# EAGLE design Keyboard (EAGLE 9.6.2)
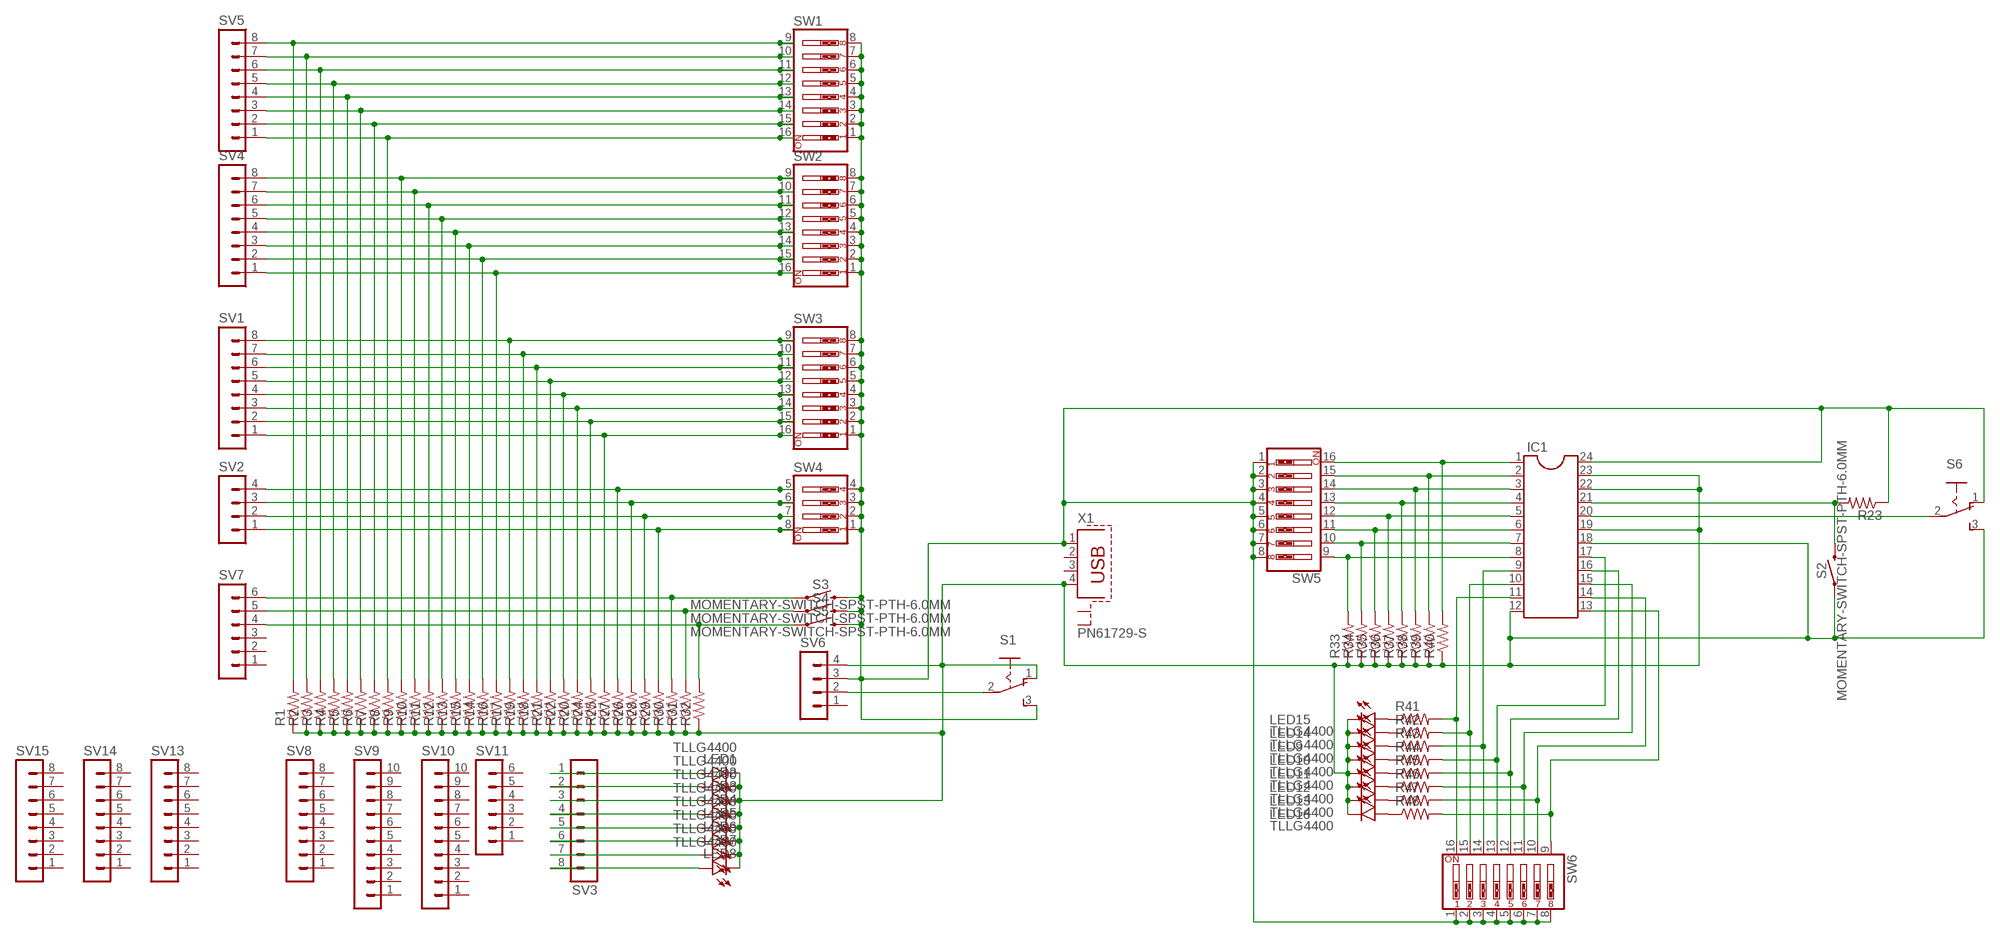
[diagram p0: schematic, sheet 1]

## Parts
IC1  DIL24-6  [DIL24-6]
LED1  TLLG4400  [LED3MM]
LED2  TLLG4400  [LED3MM]
LED3  TLLG4400  [LED3MM]
LED4  TLLG4400  [LED3MM]
LED5  TLLG4400  [LED3MM]
LED6  TLLG4400  [LED3MM]
LED7  TLLG4400  [LED3MM]
LED8  TLLG4400  [LED3MM]
LED9  TLLG4400  [LED3MM]
LED10  TLLG4400  [LED3MM]
LED11  TLLG4400  [LED3MM]
LED12  TLLG4400  [LED3MM]
LED13  TLLG4400  [LED3MM]
LED14  TLLG4400  [LED3MM]
LED15  TLLG4400  [LED3MM]
LED16  TLLG4400  [LED3MM]
R1  R-US_0207/2V  [0207/2V]
R2  R-US_0207/2V  [0207/2V]
R3  R-US_0207/2V  [0207/2V]
R4  R-US_0207/2V  [0207/2V]
R5  R-US_0207/2V  [0207/2V]
R6  R-US_0207/2V  [0207/2V]
R7  R-US_0207/2V  [0207/2V]
R8  R-US_0207/2V  [0207/2V]
R9  R-US_0207/2V  [0207/2V]
R10  R-US_0207/2V  [0207/2V]
R11  R-US_0207/2V  [0207/2V]
R12  R-US_0207/2V  [0207/2V]
R13  R-US_0207/2V  [0207/2V]
R14  R-US_0207/2V  [0207/2V]
R15  R-US_0207/2V  [0207/2V]
R16  R-US_0207/2V  [0207/2V]
R17  R-US_0207/2V  [0207/2V]
R18  R-US_0207/2V  [0207/2V]
R19  R-US_0207/2V  [0207/2V]
R20  R-US_0207/2V  [0207/2V]
R21  R-US_0207/2V  [0207/2V]
R22  R-US_0207/2V  [0207/2V]
R23  R-US_0207/2V  [0207/2V]
R24  R-US_0207/2V  [0207/2V]
R25  R-US_0207/2V  [0207/2V]
R26  R-US_0207/2V  [0207/2V]
R27  R-US_0207/2V  [0207/2V]
R28  R-US_0207/2V  [0207/2V]
R29  R-US_0207/2V  [0207/2V]
R30  R-US_0207/2V  [0207/2V]
R31  R-US_0207/2V  [0207/2V]
R32  R-US_0207/2V  [0207/2V]
R33  R-US_0207/2V  [0207/2V]
R34  R-US_0207/2V  [0207/2V]
R35  R-US_0207/2V  [0207/2V]
R36  R-US_0207/2V  [0207/2V]
R37  R-US_0207/2V  [0207/2V]
R38  R-US_0207/2V  [0207/2V]
R39  R-US_0207/2V  [0207/2V]
R40  R-US_0207/2V  [0207/2V]
R41  R-US_0207/2V  [0207/2V]
R42  R-US_0207/2V  [0207/2V]
R43  R-US_0207/2V  [0207/2V]
R44  R-US_0207/2V  [0207/2V]
R45  R-US_0207/2V  [0207/2V]
R46  R-US_0207/2V  [0207/2V]
R47  R-US_0207/2V  [0207/2V]
R48  R-US_0207/2V  [0207/2V]
S1  M251  [M251]
S2  MOMENTARY-SWITCH-SPST-PTH-6.0MM  [TACTILE_SWITCH_PTH_6.0MM]
S3  MOMENTARY-SWITCH-SPST-PTH-6.0MM  [TACTILE_SWITCH_PTH_6.0MM]
S4  MOMENTARY-SWITCH-SPST-PTH-6.0MM  [TACTILE_SWITCH_PTH_6.0MM]
S5  MOMENTARY-SWITCH-SPST-PTH-6.0MM  [TACTILE_SWITCH_PTH_6.0MM]
S6  M251  [M251]
SV1  MA08-1  [MA08-1]
SV2  MA04-1  [MA04-1]
SV3  MA08-1  [MA08-1]
SV4  MA08-1  [MA08-1]
SV5  MA08-1  [MA08-1]
SV6  MA04-1  [MA04-1]
SV7  MA06-1  [MA06-1]
SV8  MA08-1  [MA08-1]
SV9  MA10-1  [MA10-1]
SV10  MA10-1  [MA10-1]
SV11  MA06-1  [MA06-1]
SV13  MA08-1  [MA08-1]
SV14  MA08-1  [MA08-1]
SV15  MA08-1  [MA08-1]
SW1  SW_DIP-8  [EDG-08]
SW2  SW_DIP-8  [EDG-08]
SW3  SW_DIP-8  [EDG-08]
SW4  SW_DIP-4  [EDG-04]
SW5  SW_DIP-8  [EDG-08]
SW6  SW_DIP-8  [EDG-08]
X1  PN61729-S  [PN61729-S]

## Nets
N$1: R17.2 SV1.8 SW3.9
N$2: R19.2 SV1.7 SW3.10
N$3: R18.2 SV1.6 SW3.11
N$4: R21.2 SV1.5 SW3.12
N$5: R22.2 SV1.4 SW3.13
N$6: R20.2 SV1.3 SW3.14
N$7: R24.2 SV1.2 SW3.15
N$8: R25.2 SV1.1 SW3.16
N$9: R27.2 SV2.4 SW4.5
N$10: R26.2 SV2.3 SW4.6
N$11: R28.2 SV2.2 SW4.7
N$12: R29.2 SV2.1 SW4.8
N$13: R30.2 S3.1 SV7.6
N$14: R31.2 S4.1 SV7.5
N$15: R32.2 S5.1 SV7.4
N$16: R9.2 SV4.8 SW2.9
N$17: R10.2 SV4.7 SW2.10
N$18: R11.2 SV4.6 SW2.11
N$19: R12.2 SV4.5 SW2.12
N$20: R13.2 SV4.4 SW2.13
N$21: R15.2 SV4.3 SW2.14
N$22: R14.2 SV4.2 SW2.15
N$23: R16.2 SV4.1 SW2.16
N$24: R1.2 SV5.8 SW1.9
N$25: R2.2 SV5.7 SW1.10
N$26: R3.2 SV5.6 SW1.11
N$27: R4.2 SV5.5 SW1.12
N$28: R5.2 SV5.4 SW1.13
N$29: R6.2 SV5.3 SW1.14
N$30: R7.2 SV5.2 SW1.15
N$31: R8.2 SV5.1 SW1.16
N$32: IC1.9 R43.2 SW6.14
N$33: IC1.24 R23.1 S1.3(S) S3.3 S4.3 S5.3 S6.1(O) SV6.3 SW1.1 SW1.2 SW1.3 SW1.4 SW1.5 SW1.6 SW1.7 SW1.8 SW2.1 SW2.2 SW2.3 SW2.4 SW2.5 SW2.6 SW2.7 SW2.8 SW3.1 SW3.2 SW3.3 SW3.4 SW3.5 SW3.6 SW3.7 SW3.8 SW4.1 SW4.2 SW4.3 SW4.4 SW5.1 SW5.2 SW5.3 SW5.4 SW5.5 SW5.6 SW5.7 SW5.8 SW6.1 SW6.2 SW6.3 SW6.4 SW6.5 SW6.6 SW6.7 SW6.8 X1.1
N$34: IC1.20 S6.2(P)
N$35: LED1.A SV3.1
N$36: LED2.A SV3.2
N$37: LED3.A SV3.3
N$38: LED4.A SV3.4
N$39: LED5.A SV3.5
N$40: LED6.A SV3.6
N$41: LED7.A SV3.7
N$42: LED8.A SV3.8
N$43: IC1.12 IC1.18 IC1.19 IC1.22 IC1.23 LED1.K(C) LED2.K(C) LED3.K(C) LED4.K(C) LED5.K(C) LED6.K(C) LED7.K(C) LED8.K(C) LED9.K(C) LED10.K(C) LED11.K(C) LED12.K(C) LED13.K(C) LED14.K(C) LED15.K(C) LED16.K(C) R1.1 R2.1 R3.1 R4.1 R5.1 R6.1 R7.1 R8.1 R9.1 R10.1 R11.1 R12.1 R13.1 R14.1 R15.1 R16.1 R17.1 R18.1 R19.1 R20.1 R21.1 R22.1 R24.1 R25.1 R26.1 R27.1 R28.1 R29.1 R30.1 R31.1 R32.1 R33.1 R34.1 R35.1 R36.1 R37.1 R38.1 R39.1 R40.1 S1.1(O) S2.1 S6.3(S) SV6.4 X1.4
N$44: IC1.10 R42.2 SW6.15
N$45: IC1.21 R23.2 S2.3
N$46: IC1.11 R41.2 SW6.16
N$47: IC1.17 R44.2 SW6.13
N$48: IC1.16 R45.2 SW6.12
N$49: IC1.15 R46.2 SW6.11
N$50: IC1.14 R47.2 SW6.10
N$51: IC1.13 R48.2 SW6.9
N$52: IC1.1 R40.2 SW5.16
N$53: IC1.2 R39.2 SW5.15
N$54: IC1.3 R38.2 SW5.14
N$55: IC1.4 R37.2 SW5.13
N$56: IC1.5 R36.2 SW5.12
N$57: IC1.6 R35.2 SW5.11
N$58: IC1.7 R34.2 SW5.10
N$59: IC1.8 R33.2 SW5.9
N$61: LED15.A R41.1
N$62: LED14.A R42.1
N$63: LED9.A R43.1
N$64: LED10.A R44.1
N$65: LED11.A R45.1
N$66: LED12.A R46.1
N$67: LED13.A R47.1
N$68: LED16.A R48.1
N$69: S1.2(P) SV6.2
Unconnected: SV6.1 SV7.1 SV7.2 SV7.3 SV8.1 SV8.2 SV8.3 SV8.4 SV8.5 SV8.6 SV8.7 SV8.8 SV9.1 SV9.2 SV9.3 SV9.4 SV9.5 SV9.6 SV9.7 SV9.8 SV9.9 SV9.10 SV10.1 SV10.2 SV10.3 SV10.4 SV10.5 SV10.6 SV10.7 SV10.8 SV10.9 SV10.10 SV11.1 SV11.2 SV11.3 SV11.4 SV11.5 SV11.6 SV13.1 SV13.2 SV13.3 SV13.4 SV13.5 SV13.6 SV13.7 SV13.8 SV14.1 SV14.2 SV14.3 SV14.4 SV14.5 SV14.6 SV14.7 SV14.8 SV15.1 SV15.2 SV15.3 SV15.4 SV15.5 SV15.6 SV15.7 SV15.8 X1.2 X1.3 X1.S1 X1.S2

## Library data of the parts
IC1 = ic-package:DIL24: Dual In Line
LED1-LED16 = led:TLLG4400: Low Current (2mA) LED 3 mm Tinted Diffused Package color GREEN Source: Data sheet <http://www.farnell.com/datasheets/391098.pdf>; MF: VISHAY SEMICONDUCTOR; OC_FARNELL: 1612435
R1-R48 = rcl:R-US_: RESISTOR, American symbol; SPICEPREFIX: R
S1 S6 = switch:M251: SLIDING SWITCH Mors, distributor Buerklin, 11G702
S2-S5 = SparkFun-Switches:MOMENTARY-SWITCH-SPST: Momentary Switch (Pushbutton) - SPST Normally-open (NO) SPST momentary switches (buttons, pushbuttons). Variants PTH-12MM - 12mm square, through-hole Momentary Pushbutton Switch - 12mm Square <https://www.sparkfun.com/products/9190> (COM-09190) PTH-6.0MM, PTH-6.0MM-KIT - 6.0mm square, through-hole Mini Pushbutton Switch <https://www.sparkfun.com/products/97> (COM-00097) KIT package intended for soldering kit's - only one side of pads' copper is exposed. PTH-RIGHT-ANGLE-KIT - Right-angle, through-hole Right Angle Tactile Button <https://www.sparkfun.com/products/10791> - Used on SparkFun BigTime Watch Kit <https://www.sparkfun.com/products/11734> SMD-12MM - 12mm square, surface-mount Tactile Button - SMD (12mm) <https://www.sparkfun.com/products/12993> (COM-12993) Used on SparkFun PicoBoard <https://www.sparkfun.com/products/11888> SMD-4.5MM - 4.5mm Square Trackball Switch Used on SparkFun Blackberry Trackballer Breakout <https://www.sparkfun.com/products/13169> SMD-4.6MMX2.8MM - 4.60mm x 2.80mm, surface mount Used on SparkFun SAMD21 Mini Breakout <https://www.sparkfun.com/products/13664> SMD-5.2MM, SMD-5.2-REDUNDANT - 5.2mm square, surface-mount Mini Pushbutton Switch - SMD <https://www.sparkfun.com/products/8720> (COM-08720) Used on Arduino Pro Mini <https://www.sparkfun.com/products/11114> REDUNDANT package connects both switch circuits together SMD-6.0X3.5MM - 6.0 x 3.5mm, surface mount Momentary Reset Switch SMD <https://www.sparkfun.com/products/8229> (COM-08229) SMD-6.2MM-TALL - 6.2mm square, surface mount Tactile Button - SMD (6mm) <https://www.sparkfun.com/products/12992> Used on SparkFun Digital Sandbox <https://www.sparkfun.com/products/12651> SMD-RIGHT-ANGLE - Right-angle, surface mount Used on SparkFun Block for Intel® Edison - Arduino <https://www.sparkfun.com/products/13036>; PROD_ID: SWCH-08441; SF_SKU: COM-00097
SV1 SV3-SV5 SV8 SV13-SV15 = con-lstb:MA08-1: PIN HEADER; OC_FARNELL: unknown; OC_NEWARK: unknown
SV2 SV6 = con-lstb:MA04-1: PIN HEADER; OC_FARNELL: unknown; OC_NEWARK: unknown
SV7 SV11 = con-lstb:MA06-1: PIN HEADER; OC_FARNELL: unknown; OC_NEWARK: unknown
SV9 SV10 = con-lstb:MA10-1: PIN HEADER; OC_FARNELL: unknown; OC_NEWARK: unknown
SW1-SW3 SW5 SW6 = special:SW_DIP-8: DIP SWITCH
SW4 = special:SW_DIP-4: DIP SWITCH
X1 = con-berg:PN61729-S: BERG USB connector; OC_FARNELL: unknown; OC_NEWARK: unknown

## Net classes
0 default: width 0.381 mm, drill 0.508 mm, clearance 0.254 mm

## Board
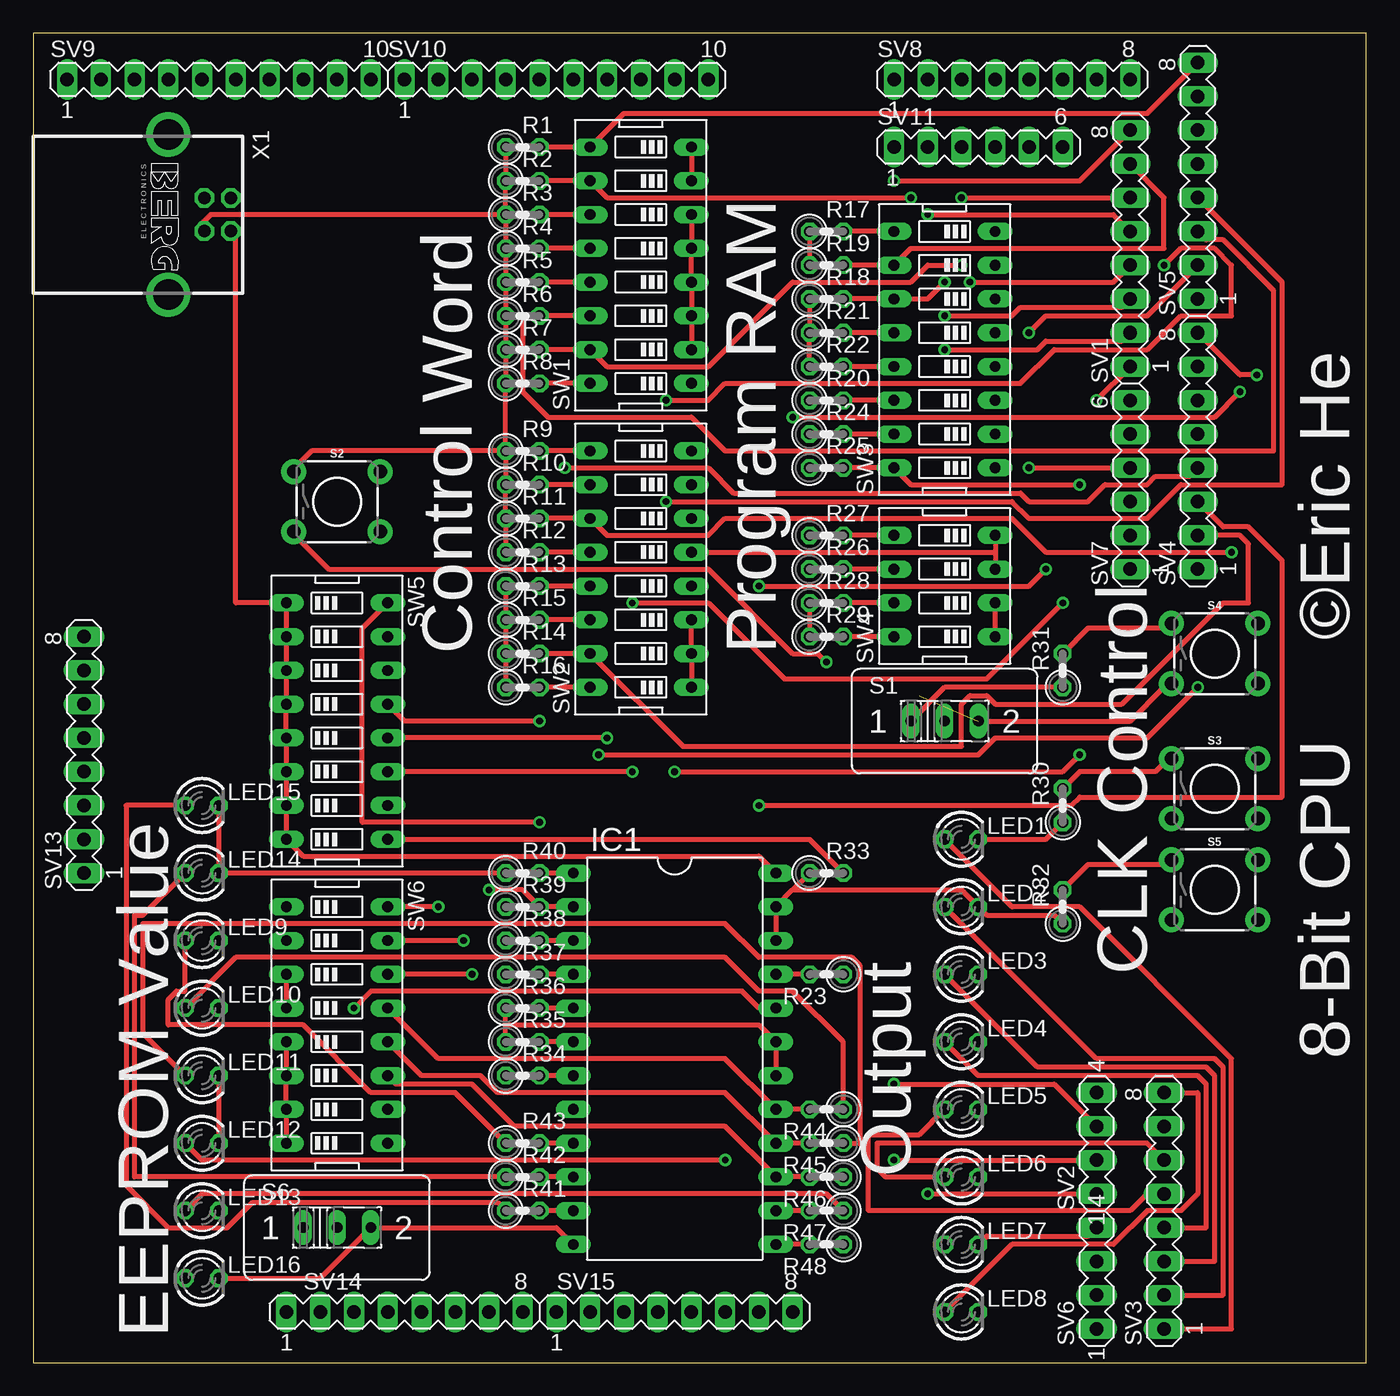
[diagram p1: board, top side]
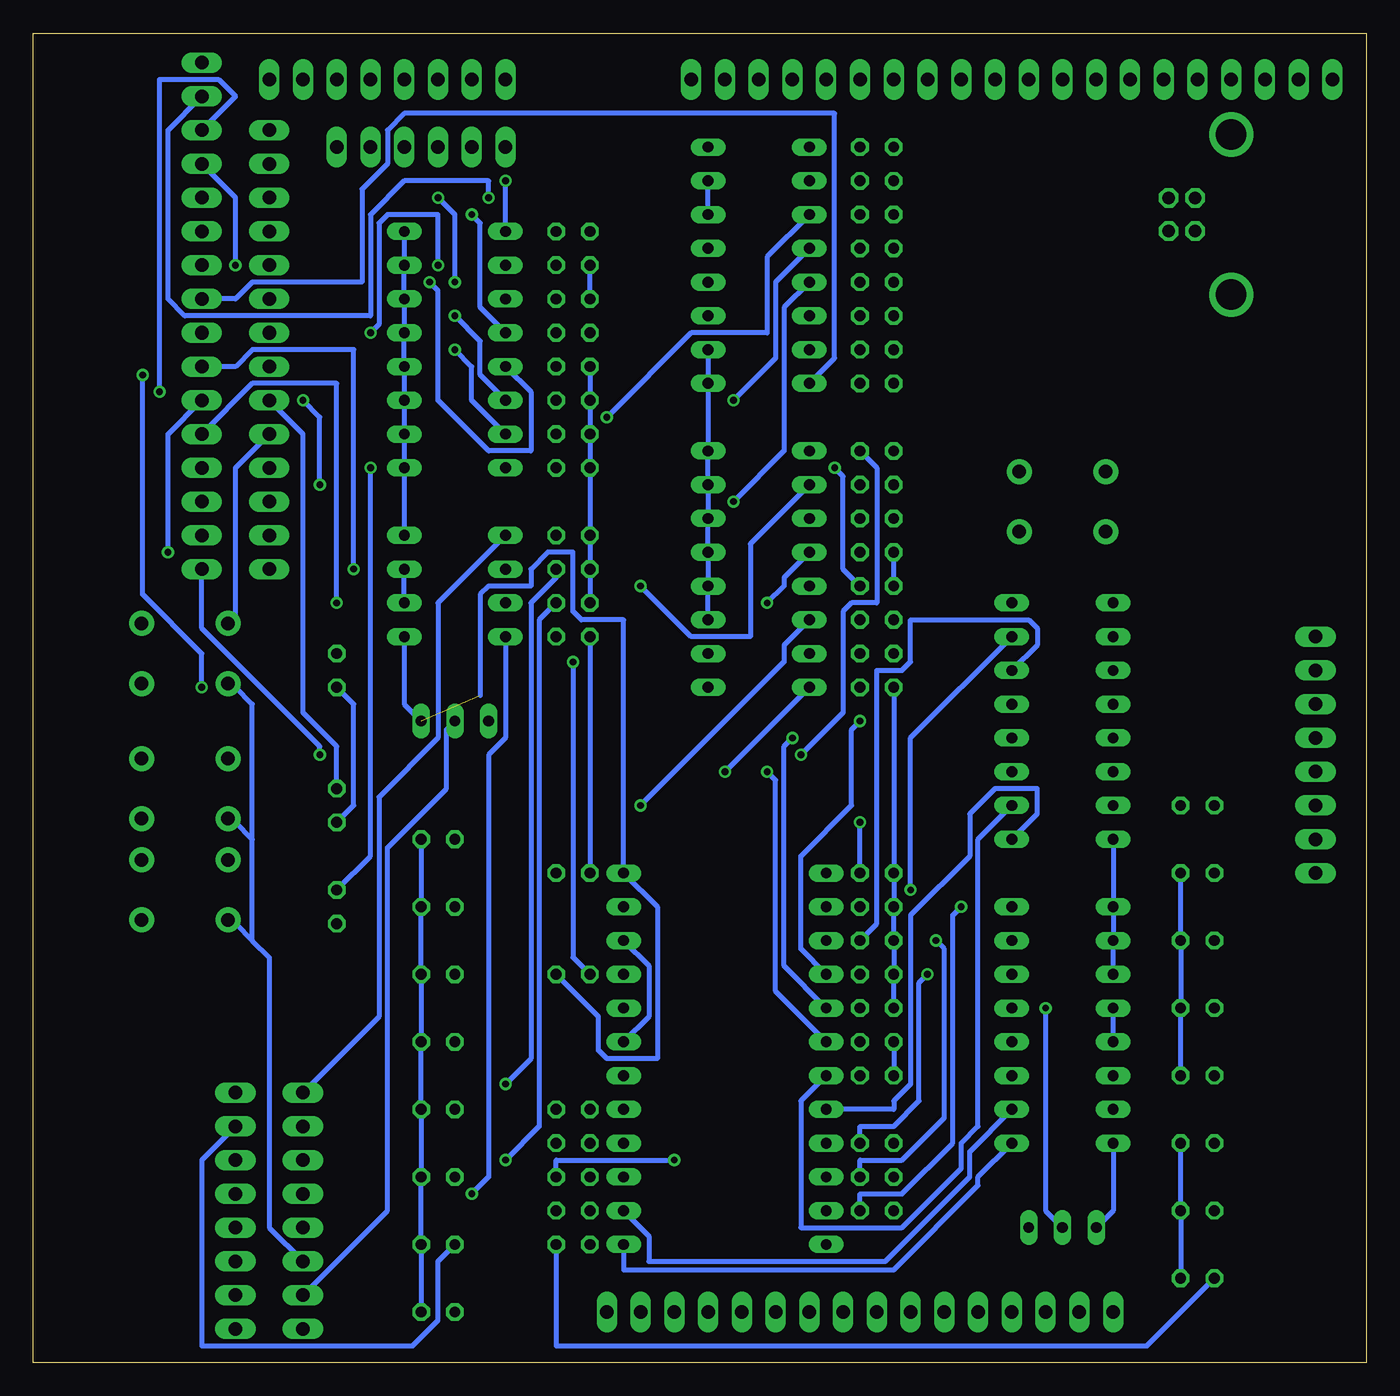
[diagram p2: board, bottom side, seen from below]

Size 100.31 x 100 mm. Coordinates in mm from the lower left corner, seen from the top.
Outline: 0,0 100.31,0 100.31,100 0,100 0,0
Copper layers (1*16): Top 0.035mm / dielectric 1.5mm / Bottom 0.035mm
Design rules "default": minimum track width 6mil, minimum drill 0.35mm, track to track 6mil, track to pad 6mil, pad to pad 6mil, via to via 6mil, smd to smd 6mil, copper to edge 40mil, drill to drill 6mil, minimum pad ring 10mil, minimum via ring 8mil, stop-mask expansion 4mil, vias tented up to drill 0mil, thermal gap 10mil

### Footprints (pad centres in the part's own frame; a part is rotated, then mirrored left to right if it is on the bottom)
DIL24-6 = drill 0.813 long: 1 -13.97,-7.62; 2 -11.43,-7.62; 3 -8.89,-7.62; 4 -6.35,-7.62; 5 -3.81,-7.62; 6 -1.27,-7.62; 7 1.27,-7.62; 8 3.81,-7.62; 9 6.35,-7.62; 10 8.89,-7.62; 11 11.43,-7.62; 12 13.97,-7.62; 13 13.97,7.62; 14 11.43,7.62; 15 8.89,7.62; 16 6.35,7.62; 17 3.81,7.62; 18 1.27,7.62; 19 -1.27,7.62; 20 -3.81,7.62; 21 -6.35,7.62; 22 -8.89,7.62; 23 -11.43,7.62; 24 -13.97,7.62
LED3MM = drill 0.813 octagon: A -1.27,0; K 1.27,0
0207/2V = drill 0.813 octagon: 1 -1.27,0; 2 1.27,0
M251 = drill 0.813 long: 1 -2.54,0; 2 0,0; 3 2.54,0
TACTILE_SWITCH_PTH_6.0MM = drill 1.016 pad 1.88: 1 -3.251,2.261; 2 3.251,2.261; 3 -3.251,-2.261; 4 3.251,-2.261
MA08-1 = drill 1.016 long: 1 -8.89,0; 2 -6.35,0; 3 -3.81,0; 4 -1.27,0; 5 1.27,0; 6 3.81,0; 7 6.35,0; 8 8.89,0
MA04-1 = drill 1.016 long: 1 -3.81,0; 2 -1.27,0; 3 1.27,0; 4 3.81,0
MA06-1 = drill 1.016 long: 1 -6.35,0; 2 -3.81,0; 3 -1.27,0; 4 1.27,0; 5 3.81,0; 6 6.35,0
MA10-1 = drill 1.016 long: 1 -11.43,0; 2 -8.89,0; 3 -6.35,0; 4 -3.81,0; 5 -1.27,0; 6 1.27,0; 7 3.81,0; 8 6.35,0; 9 8.89,0; 10 11.43,0
EDG-08 = drill 0.813 long: 1 -8.89,-3.81; 2 -6.35,-3.81; 3 -3.81,-3.81; 4 -1.27,-3.81; 5 1.27,-3.81; 6 3.81,-3.81; 7 6.35,-3.81; 8 8.89,-3.81; 9 8.89,3.81; 10 6.35,3.81; 11 3.81,3.81; 12 1.27,3.81; 13 -1.27,3.81; 14 -3.81,3.81; 15 -6.35,3.81; 16 -8.89,3.81
EDG-04 = drill 0.813 long: 1 -3.81,-3.81; 2 -1.27,-3.81; 3 1.27,-3.81; 4 3.81,-3.81; 5 3.81,3.81; 6 1.27,3.81; 7 -1.27,3.81; 8 -3.81,3.81
PN61729-S = drill 0.95 octagon: 1 1.25,4.71; 2 -1.25,4.71; 3 -1.25,2.71; 4 1.25,2.71 | drill 2.3 pad 2.9: S1 -6.02,0; S2 6.02,0

### Placement (x,y rotation side)
IC1  48.26,22.86 270 top
LED1  69.85,39.37 0 top
LED2  69.85,34.29 0 top
LED3  69.85,29.21 0 top
LED4  69.85,24.13 0 top
LED5  69.85,19.05 0 top
LED6  69.85,13.97 0 top
LED7  69.85,8.89 0 top
LED8  69.85,3.81 0 top
LED9  12.7,31.75 0 top
LED10  12.7,26.67 0 top
LED11  12.7,21.59 0 top
LED12  12.7,16.51 0 top
LED13  12.7,11.43 0 top
LED14  12.7,36.83 0 top
LED15  12.7,41.91 0 top
LED16  12.7,6.35 0 top
R1  36.83,91.44 0 top
R2  36.83,88.9 0 top
R3  36.83,86.36 0 top
R4  36.83,83.82 0 top
R5  36.83,81.28 0 top
R6  36.83,78.74 0 top
R7  36.83,76.2 0 top
R8  36.83,73.66 0 top
R9  36.83,68.58 0 top
R10  36.83,66.04 0 top
R11  36.83,63.5 0 top
R12  36.83,60.96 0 top
R13  36.83,58.42 0 top
R14  36.83,53.34 0 top
R15  36.83,55.88 0 top
R16  36.83,50.8 0 top
R17  59.69,85.09 0 top
R18  59.69,80.01 0 top
R19  59.69,82.55 0 top
R20  59.69,72.39 0 top
R21  59.69,77.47 0 top
R22  59.69,74.93 0 top
R23  59.69,29.21 180 top
R24  59.69,69.85 0 top
R25  59.69,67.31 0 top
R26  59.69,59.69 0 top
R27  59.69,62.23 0 top
R28  59.69,57.15 0 top
R29  59.69,54.61 0 top
R30  77.47,41.91 90 top
R31  77.47,52.07 90 top
R32  77.47,34.29 90 top
R33  59.69,36.83 0 top
R34  36.83,21.59 0 top
R35  36.83,24.13 0 top
R36  36.83,26.67 0 top
R37  36.83,29.21 0 top
R38  36.83,31.75 0 top
R39  36.83,34.29 0 top
R40  36.83,36.83 0 top
R41  36.83,11.43 0 top
R42  36.83,13.97 0 top
R43  36.83,16.51 0 top
R44  59.69,19.05 180 top
R45  59.69,16.51 180 top
R46  59.69,13.97 180 top
R47  59.69,11.43 180 top
R48  59.69,8.89 180 top
S1  68.58,48.26 0 top
S2  22.86,64.77 0 top
S3  88.9,43.18 0 top
S4  88.9,53.34 0 top
S5  88.9,35.56 0 top
S6  22.86,10.16 0 top
SV1  82.55,83.82 90 top
SV2  80.01,16.51 90 top
SV3  85.09,11.43 90 top
SV4  87.63,68.58 90 top
SV5  87.63,88.9 90 top
SV6  80.01,6.35 90 top
SV7  82.55,66.04 90 top
SV8  73.66,96.52 0 top
SV9  13.97,96.52 0 top
SV10  39.37,96.52 0 top
SV11  71.12,91.44 0 top
SV13  3.81,45.72 90 top
SV14  27.94,3.81 0 top
SV15  48.26,3.81 0 top
SW1  45.72,82.55 90 top
SW2  45.72,59.69 90 top
SW3  68.58,76.2 90 top
SW4  68.58,58.42 90 top
SW5  22.86,48.26 270 top
SW6  22.86,25.4 270 top
X1  10.16,86.36 270 top

### Tracks (layer width: path | path; a pad name or v marks a point on that pad's centre or on a via)
N$1  (via drill 0.51)
  Top 0.381: SW3.9 R17.2 | SV1.8 78.74,88.9 v64.77,88.9
  Bottom 0.381: SW3.9 v64.77,88.9
N$2
  Top 0.381: R19.2 SW3.10 66.04,83.82 85.09,83.82 85.09,87.63 SV1.7
N$3  (via drill 0.51)
  Top 0.381: R18.2 SW3.11 67.31,80.01 v68.58,81.28 | v69.85,87.63 SV1.6
  Bottom 0.381: v69.85,87.63 68.58,86.36 v68.58,81.28
N$4  (via drill 0.51)
  Top 0.381: SW3.12 R21.2 | SV1.5 81.28,86.36 v67.31,86.36
  Bottom 0.381: v67.31,86.36 66.67,85.72 66.67,79.38 SW3.12
N$5  (via drill 0.51)
  Top 0.381: SW3.13 R22.2 | SV1.4 81.28,81.28 v70.48,81.28
  Bottom 0.381: v70.48,81.28 69.85,80.64 69.85,72.39 66.04,68.58 62.87,68.58 62.87,73.03 SW3.13
N$6  (via drill 0.51)
  Top 0.381: SW3.14 R20.2 | SV1.3 81.92,79.38 74.3,79.38 73.66,78.74 v68.58,78.74
  Bottom 0.381: v68.58,78.74 66.67,76.83 66.67,74.3 SW3.14
N$7  (via drill 0.51)
  Top 0.381: SW3.15 R24.2 | SV1.2 81.92,76.83 76.2,76.83 75.56,76.2 v68.58,76.2
  Bottom 0.381: v68.58,76.2 67.31,74.93 67.31,72.39 SW3.15
N$8  (via drill 0.51)
  Top 0.381: R25.2 SW3.16 66.04,66.04 v78.74,66.04 | v80.01,72.39 SV1.1
  Bottom 0.381: v80.01,72.39 78.74,71.12 v78.74,66.04
N$9
  Top 0.381: SW4.5 R27.2
  Bottom 0.381: SV2.4 74.3,26.04 74.3,42.55 69.85,46.99 69.85,57.15 SW4.5
N$10  (via drill 0.51)
  Top 0.381: SW4.6 R26.2 | SV2.3 76.83,20.95 v64.77,20.95
  Bottom 0.381: v64.77,20.95 62.87,22.86 62.87,57.15 60.96,59.05 R26.2
N$11  (via drill 0.51)
  Top 0.381: SW4.7 R28.2 | v64.77,15.24 SV2.2
  Bottom 0.381: v64.77,15.24 62.23,17.78 62.23,55.88 R28.2
N$12  (via drill 0.51)
  Top 0.381: SW4.8 R29.2 | v67.31,12.7 SV2.1
  Bottom 0.381: v67.31,12.7 66.04,13.97 66.04,45.72 64.77,46.99 SW4.8
N$13
  Top 0.381: R30.2 78.74,44.45 84.45,44.45 85.09,45.09 S3.1
  Bottom 0.381: SV7.6 80.01,69.85 80.01,48.9 77.47,46.35 R30.2
N$14
  Top 0.381: R31.2 79.38,55.24 85.09,55.24 S4.1
  Bottom 0.381: SV7.5 85.09,67.31 85.09,55.88 S4.1
N$15  (via drill 0.51)
  Top 0.381: R32.2 79.38,37.47 85.09,37.47 S5.1 | v74.93,67.31 SV7.4
  Bottom 0.381: v74.93,67.31 74.93,38.1 R32.2
N$16  (via drill 0.51)
  Top 0.381: SW2.9 R9.2 | SV4.8 90.81,74.3 v92.08,74.3 | v87.63,50.8 83.82,46.99 72.39,46.99 71.12,45.72 v42.55,45.72
  Bottom 0.381: v92.08,74.3 92.08,57.78 87.63,53.34 v87.63,50.8 | v42.55,45.72 39.37,48.9 39.37,56.52 38.73,57.15 36.83,57.15 36.83,67.31 R9.2
N$17  (via drill 0.51)
  Top 0.381: SW2.10 R10.2 | v76.2,59.69 74.93,58.42 v54.61,58.42
  Bottom 0.381: SV4.7 85.09,74.93 83.82,76.2 76.2,76.2 v76.2,59.69 | v54.61,58.42 50.8,54.61 46.35,54.61 46.35,61.59 SW2.10
N$18  (via drill 0.51)
  Top 0.381: R11.2 SW2.11 43.18,62.23 50.8,62.23 52.07,63.5 73.66,63.5 76.2,60.96 v90.17,60.96
  Bottom 0.381: SV4.6 90.17,69.85 v90.17,60.96
N$19  (via drill 0.51)
  Top 0.381: SW2.12 R12.2 | v77.47,57.15 71.75,51.44 56.52,51.44 50.8,57.15 v45.09,57.15
  Bottom 0.381: SV4.5 83.82,73.66 77.47,73.66 v77.47,57.15 | v45.09,57.15 43.81,58.42 43.81,59.05 SW2.12
N$20  (via drill 0.51)
  Top 0.381: SW2.13 R13.2 | SV4.4 87,66.67 84.45,66.67 83.82,66.04 80.64,66.04 79.38,64.77 74.93,64.77 74.3,65.41 52.7,65.41 50.8,67.31 v40.01,67.31
  Bottom 0.381: v40.01,67.31 39.37,66.67 39.37,59.69 R13.2
N$21  (via drill 0.51)
  Top 0.381: SW2.14 R15.2 | SV4.3 89.53,62.87 91.44,62.87 93.98,60.33 93.98,42.55 78.74,42.55 78.11,41.91 v54.61,41.91
  Bottom 0.381: v54.61,41.91 43.81,52.7 43.81,53.98 SW2.14
N$22
  Top 0.381: R14.2 SW2.15 48.9,46.35 69.85,46.35 69.85,49.53 70.48,50.16 71.75,50.16 72.39,49.53 81.92,49.53 89.53,57.15 91.44,57.15 91.44,61.59 90.81,62.23 SV4.2
N$23  (via drill 0.51)
  Top 0.381: SW2.16 R16.2 | v78.74,45.72 77.47,44.45 v48.26,44.45
  Bottom 0.381: SV4.1 87.63,55.24 78.74,46.35 v78.74,45.72 | SW2.16 v48.26,44.45
N$24
  Top 0.381: R1.2 SW1.9 44.45,93.98 83.82,93.98 SV5.8
N$25  (via drill 0.51)
  Top 0.381: R2.2 SW1.10 43.18,87.63 v66.04,87.63
  Bottom 0.381: SV5.7 90.17,92.71 90.17,80.01 88.9,78.74 74.93,78.74 74.93,86.36 72.39,88.9 66.04,88.9 v66.04,87.63
N$26  (via drill 0.51)
  Top 0.381: SW1.11 R3.2 | v90.81,73.03 88.9,71.12 v57.15,71.12
  Bottom 0.381: SV5.6 85.09,95.25 86.36,96.52 90.81,96.52 v90.81,73.03 | v57.15,71.12 50.8,77.47 45.09,77.47 45.09,83.19 SW1.11
N$27  (via drill 0.51)
  Top 0.381: SW1.12 R4.2 | v85.09,82.55 86.36,83.82 88.9,83.82 90.17,82.55 90.17,78.74 86.36,78.74 83.82,76.2 76.83,76.2 74.3,73.66 52.07,73.66 50.8,72.39 v47.62,72.39
  Bottom 0.381: SV5.5 85.09,87.63 v85.09,82.55 | v47.62,72.39 44.45,75.56 44.45,81.28 SW1.12
N$28  (via drill 0.51)
  Top 0.381: SW1.13 R5.2 | SV5.4 93.98,81.28 93.98,66.04 86.36,66.04 83.82,63.5 74.93,63.5 73.66,64.77 v47.62,64.77
  Bottom 0.381: v47.62,64.77 43.81,68.58 43.81,79.38 SW1.13
N$29
  Top 0.381: SW1.14 R6.2 36.83,78.74 36.83,73.03 38.73,71.12 49.53,71.12 52.07,68.58 93.34,68.58 93.34,80.64 89.53,84.45 88.27,84.45 SV5.3
N$30  (via drill 0.51)
  Top 0.381: R7.2 SW1.15 43.18,74.93 50.8,74.93 57.15,81.28 66.04,81.28 67.31,82.55 v69.85,82.55 | SV5.2 83.82,78.74 76.2,78.74 v74.93,77.47
  Bottom 0.381: v74.93,77.47 74.3,78.11 74.3,85.72 73.66,86.36 69.85,86.36 v69.85,82.55
N$31
  Top 0.381: SW1.16 R8.2
  Bottom 0.381: SV5.1 85.09,80.01 83.82,81.28 75.56,81.28 75.56,88.27 73.66,90.17 73.66,92.71 72.39,93.98 40.01,93.98 40.01,75.56 SW1.16
N$32  (via drill 0.51)
  Top 0.381: IC1.9 R43.2 | v33.02,29.21 SW6.14
  Bottom 0.381: v33.02,29.21 33.66,28.57 33.66,19.68 35.56,17.78 38.1,17.78 R43.2
N$33  (1 unrouted)
  Top 0.381: SW4.4 72.39,60.96 | 72.39,60.96 SW4.3 | SW4.1 SW4.2 | SW2.1 SW2.2 SW2.3 | SW1.8 SW1.7 | SW1.6 SW1.5 SW1.4 SW1.3 SW1.2 | SW2.5 72.39,60.96 | S1.3 82.55,48.26 85.09,50.8 S4.3 | SW6.3 SW6.4 | SW6.5 SW6.6 SW6.7 SW6.8 | X1.1 15.24,85.09 15.24,57.15 SW5.1 SW5.2 SW5.3 SW5.4 SW5.5 SW5.6 SW5.7 SW5.8 20.32,38.1 54.61,38.1 IC1.24
  Bottom 0.381: SV6.3 82.55,10.16 82.55,30.48 83.82,31.75 | 83.82,31.75 85.09,33.02 S5.3 | 83.82,39.37 85.09,40.64 S3.3 | 83.82,31.75 83.82,39.37 | 83.82,39.37 83.82,49.53 85.09,50.8 S4.3 | S1.3 72.39,49.53 SW4.1 | SW4.2 SW4.3 | SW3.8 SW3.7 SW3.6 SW3.5 SW3.4 SW3.3 SW3.2 SW3.1 SW4.4 | SW2.3 SW2.4 SW2.5 SW2.6 SW2.7 SW2.8 SW1.1 SW1.2 | SW1.6 SW1.7 | S6.1 19.05,11.43 SW6.8 | SW6.5 SW6.4 | SW6.3 SW6.2 SW6.1 SW5.8 | R23.1 57.78,26.04 57.78,23.5 57.15,22.86 53.34,22.86 53.34,34.29 IC1.24 55.88,55.88 59.05,55.88 59.69,56.52 59.69,60.96 61.59,60.96 62.87,59.69 62.87,58.42 66.04,58.42 66.67,57.78 66.67,50.16
N$34  (via drill 0.51)
  Top 0.381: v24.13,26.67 25.4,27.94 53.34,27.94 54.61,26.67 IC1.20
  Bottom 0.381: S6.2 24.13,11.43 v24.13,26.67
N$35
  Top 0.381: LED1.A 73.66,34.29 78.74,34.29 90.17,22.86 90.17,2.54 SV3.1
N$36
  Top 0.381: LED2.A 80.01,22.86 88.9,22.86 89.53,22.23 89.53,5.08 SV3.2
N$37
  Top 0.381: LED3.A 75.56,22.23 88.27,22.23 88.9,21.59 88.9,7.62 SV3.3
N$38
  Top 0.381: LED4.A 71.12,21.59 87.63,21.59 88.27,20.95 88.27,10.16 SV3.4
N$39
  Top 0.381: LED5.A 66.67,17.14 62.87,17.14 62.87,11.43 82.55,11.43 83.82,12.7 SV3.5
N$40
  Top 0.381: LED6.A 64.14,13.97 63.5,14.61 63.5,16.51 83.82,16.51 SV3.6
N$41
  Bottom 0.381: LED7.A 69.85,7.62 69.85,3.17 71.75,1.27 87.63,1.27 87.63,15.24 SV3.7
N$42
  Top 0.381: LED8.A 73.66,8.89 81.28,8.89 83.82,11.43 86.36,11.43 87.63,12.7 87.63,20.32 SV3.8
N$43
  Top 0.381: S1.1 68.58,50.8 R31.1 | R32.1 76.83,33.66 71.75,33.66 LED2.K 69.85,35.56 57.15,35.56 | R30.1 76.2,39.37 LED1.K | SV6.4 79.38,9.53 71.75,9.53 LED7.K | IC1.18 IC1.19 54.61,25.4 35.56,25.4 | IC1.22 IC1.23 57.15,35.56 | 57.15,35.56 R33.1 | R28.1 R29.1 | R17.1 R19.1 | R18.1 R21.1 R22.1 | LED15.K LED14.K R40.1 | LED11.K LED12.K | LED16.K 21.59,6.35 S6.3 39.37,10.16 IC1.12 | R1.1 R2.1 R3.1 | R3.1 R4.1 R5.1 R6.1 R7.1 R8.1 R9.1 | R3.1 13.34,86.36 12.7,85.72 X1.4 | R35.1 35.56,25.4 | 35.56,25.4 R36.1 | R9.1 R10.1 R11.1 R12.1 | R16.1 R14.1 R15.1 R13.1 | R9.1 20.95,68.58 19.68,67.31 S2.1
  Bottom 0.381: LED1.K LED2.K LED3.K LED4.K LED5.K LED6.K LED7.K LED8.K | R31.1 76.2,49.53 76.2,41.91 R30.1 | IC1.19 53.98,26.04 53.98,29.84 IC1.22 | R28.1 R26.1 R27.1 R25.1 R24.1 R20.1 R22.1 | R18.1 R19.1 | R29.1 R33.1 | LED16.K LED13.K LED12.K | LED11.K LED10.K LED9.K LED14.K | R35.1 R34.1 | R36.1 R37.1 R38.1 R39.1 R40.1 R16.1 | R13.1 R12.1
N$44  (via drill 0.51)
  Top 0.381: IC1.10 R42.2 | v32.38,31.75 SW6.15
  Bottom 0.381: v32.38,31.75 31.75,31.11 31.75,18.41 34.92,15.24 38.1,15.24 R42.2
N$45  (via drill 0.51)
  Top 0.381: R23.2 IC1.21 | v59.69,52.7 59.05,53.34 57.15,53.34 50.8,59.69 22.23,59.69 19.68,62.23 S2.3
  Bottom 0.381: R23.2 59.69,30.48 v59.69,52.7
N$46  (via drill 0.51)
  Top 0.381: IC1.11 R41.2 | v30.48,34.29 SW6.16
  Bottom 0.381: v30.48,34.29 31.11,33.66 31.11,16.51 34.92,12.7 38.1,12.7 R41.2
N$47
  Top 0.381: R44.2 IC1.17 52.07,22.86 30.48,22.86 SW6.13
N$48
  Top 0.381: R45.2 IC1.16 52.07,20.32 34.92,20.32 33.66,21.59 29.21,21.59 SW6.12
N$49
  Top 0.381: R46.2 IC1.15 52.07,17.78 36.2,17.78 33.02,20.95 27.3,20.95 SW6.11
N$50
  Top 0.381: R47.2 IC1.14
  Bottom 0.381: SW6.10 29.84,15.88 29.84,13.97 36.2,7.62 53.98,7.62 53.98,9.53 IC1.14
N$51
  Top 0.381: R48.2 IC1.13
  Bottom 0.381: SW6.9 29.21,13.97 29.21,13.34 35.56,6.99 55.88,6.99 IC1.13
N$52  (via drill 0.51)
  Top 0.381: IC1.1 R40.2 | SW5.16 24.77,55.24 24.77,40.64 v38.1,40.64
  Bottom 0.381: R40.2 v38.1,40.64
N$53  (via drill 0.51)
  Top 0.381: IC1.2 R39.2 36.83,35.56 v34.29,35.56
  Bottom 0.381: SW5.15 34.29,46.99 v34.29,35.56
N$54
  Top 0.381: IC1.3 R38.2
  Bottom 0.381: SW5.14 24.77,53.98 24.77,55.24 25.4,55.88 34.29,55.88 34.29,52.7 34.92,52.07 36.83,52.07 36.83,33.02 R38.2
N$55  (via drill 0.51)
  Top 0.381: IC1.4 R37.2 | SW5.13 27.94,48.26 v38.1,48.26
  Bottom 0.381: v38.1,48.26 38.73,47.62 38.73,41.91 42.55,38.1 42.55,31.11 IC1.4
N$56  (via drill 0.51)
  Top 0.381: IC1.5 R36.2 | v43.18,46.99 SW5.12
  Bottom 0.381: v43.18,46.99 43.81,46.35 43.81,29.84 IC1.5
N$57  (via drill 0.51)
  Top 0.381: IC1.6 R35.2 | v45.09,44.45 SW5.11
  Bottom 0.381: v45.09,44.45 44.45,43.81 44.45,27.94 IC1.6
N$58
  Top 0.381: IC1.7 R34.2
  Bottom 0.381: SW5.10 29.21,39.37 29.21,17.78 30.48,16.51 30.48,14.61 34.92,10.16 42.55,10.16 42.55,19.68 IC1.7
N$59
  Top 0.381: R33.2 58.42,39.37 SW5.9
  Bottom 0.381: IC1.8 35.56,19.05 35.56,19.68 34.29,20.95 34.29,33.66 29.84,38.1 29.84,41.27 27.94,43.18 24.77,43.18 24.77,41.27 SW5.9
N$61
  Top 0.381: R41.1 34.92,12.06 16.51,12.06 14.61,10.16 10.16,10.16 6.99,13.34 6.99,41.91 LED15.A
N$62
  Top 0.381: LED14.A 8.26,33.66 7.62,33.66 7.62,13.97 R42.1
N$63
  Top 0.381: LED9.A 11.43,27.94 10.79,27.94 10.16,27.3 10.16,25.4 20.32,25.4 25.4,20.32 31.75,20.32 R43.1
N$64
  Top 0.381: LED10.A 15.24,30.48 52.07,30.48 54.61,27.94 57.15,27.94 60.96,24.13 R44.1
N$65
  Top 0.381: LED11.A 8.26,24.77 8.26,33.02 52.07,33.02 54.61,30.48 61.59,30.48 62.23,29.84 62.23,16.51 R45.1
N$66  (via drill 0.51)
  Top 0.381: LED12.A 12.7,15.24 v52.07,15.24
  Bottom 0.381: v52.07,15.24 60.96,15.24 R46.1
N$67
  Top 0.381: LED13.A 12.7,12.7 59.69,12.7 R47.1
N$68
  Bottom 0.381: LED16.A 16.51,1.27 60.96,1.27 R48.1
N$69
  Bottom 0.381: S1.2 69.22,47.62 69.22,43.18 73.66,38.73 73.66,11.43 SV6.2

### Text on the board
tPlace: Control Word | Program RAM | EEPROM Value | CLK Control | 8-Bit CPU ©Eric He | Output